# Altium schematic sheet CAN_TRANSCEIVER.SchDoc
size A; SheetNumber: 3; SheetTotal: 9
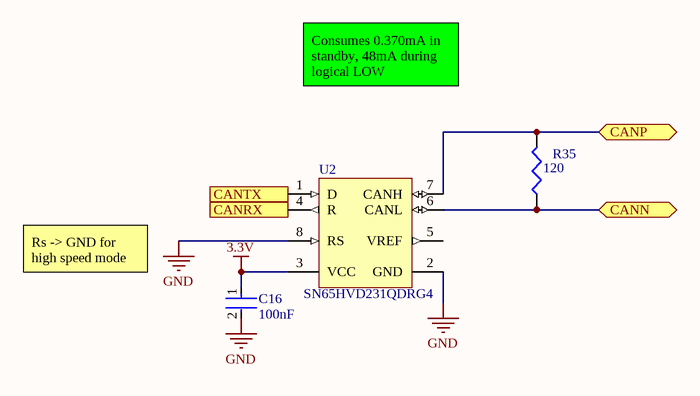
[diagram p0: CAN_TRANSCEIVER.SchDoc]

## Parts
C16  100nF  [FP-C0603C-CF-MFG]
R35  120  [J1-0603]
U2  SN65HVD231QDRG4  [D0008A_N]

## Ports
CANN (bidir), CANP (bidir), CANRX (out), CANTX (in)

## Nets
3.3V: C16.1 U2.3(VCC)
GND: C16.2 U2.2(GND) U2.8(RS)
CANN: R35.1 U2.6(CANL) ; port CANN
CANP: R35.2 U2.7(CANH) ; port CANP
CANRX: U2.4(R) ; port CANRX
CANTX: U2.1(D) ; port CANTX

Not connected (* = marked no-connect by the designer): U2 5(VREF)

## Notes on the sheet
- Consumes 0.370mA in standby, 48mA during logical LOW
- Rs -> GND for high speed mode

## Library data of the parts
C16 = CMP-2006-03061-2: Any 0603 Cap is fine here; Manufacturer: KEMET; Manufacturer Part Number: C0603C104K5RACTU; Tolerance: 0.1; Temperature Coefficient: 30ppm/°C; Material: Ceramic; Automotive Grade: Grade 1; Voltage Rating: 50 V; Value: 0.10 μF; Temperature Characteristic: X7R; Temperature: -55°C to +125°C; RoHS: TRUE; Temperature Range High: +125°C; Lead Free: Yes; Octopart: https://octopart.com/c0603c104k5ractu-kemet-139244; Digikey Description: CAP CER 0.1UF 50V X7R 0603; Category: Cap; Package: C0603C-CF; ComponentLink2Description: Datasheet; Temperature Range Low: -55°C; Device Class L1: Passive Components; Automotive: Yes; Device Class L3: Ceramic Capacitors; ComponentLink2URL: https://api.kemet.com/component-edge/download/datasheet/C0603C100J5GACAUTO.pdf; Capacitance: 0.10 μF; Device Class L2: Capacitors; Height: 0.87mm
R35 = Res3: Resistor; Published: 8-Jun-2000; LatestRevisionDate: 29-May-2009; LatestRevisionNote: IPC-7351 Footprint Added.; PackageReference: J1-0603; Publisher: Altium Limited; PackageDescription: Chip Resistor; Value: 120
U2 = CMP-0315-00044-2: Automotive Catalog CAN Transceiver, 17 mA, 3.3 V, -40 to 125 degC, 8-pin SOIC (D), Green (RoHS & no Sb/Br); PartNumber: SN65HVD231QDRQ1; Manufacturer: Texas Instruments; ICC(Max)(mA): 17; Supply Voltage(s)(V): 3.3; Receivers Per Package: 1; Transient Pulse Protection(V): -25 to 25; ComponentLink1URL: http://www.ti.com/general/docs/lit/getliterature.tsp?genericPartNumber=SN65HVD231Q-Q1&fileType=pdf; Code_JEDEC: MS-012AA; Eco-Plan: Green (RoHS & no Sb/Br); DatasheetVersion: SGLS398A; PackageReference: D0008A; ComponentLink1Description: Datasheet; SubFamily: CAN; PackageVersion: revM, Jun-2011; Rating: Automotive; Mounting Technology: Surface Mount; Footprint: PCA82C250; Drivers Per Package: 1; PackageDescription: 8-Pin Plastic Small Outline Integrated Circuit, 4.9 x 3.9 mm, Pitch 1.27 mm Pitch; Isolated: No